# EAGLE design Adafruit Mini PiTFT - 135x240 Color TFT (EAGLE 9.5.0)
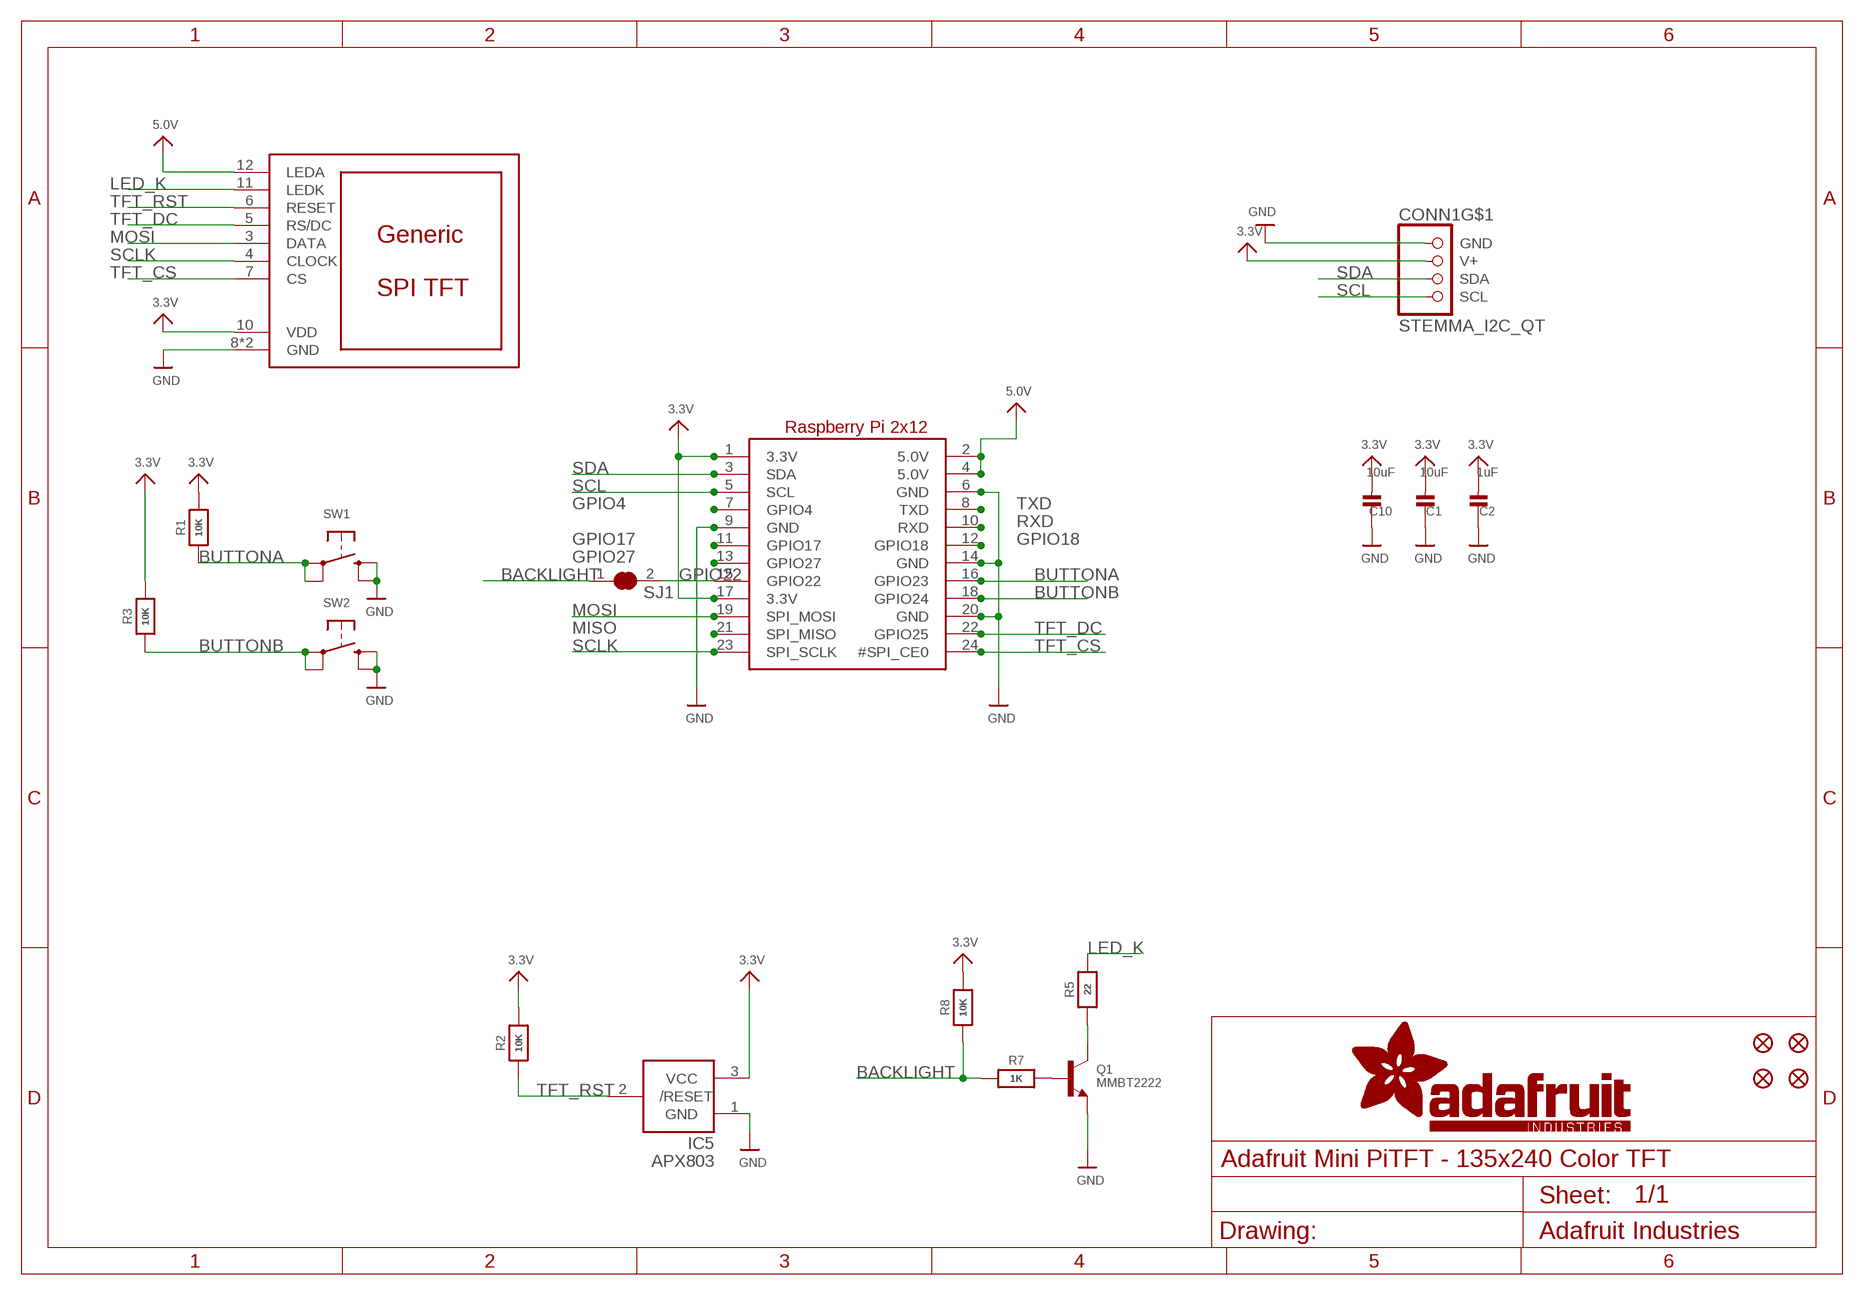
[diagram p0: schematic, sheet 1]

## Parts
C1  10uF  CAP_CERAMIC0805-NOOUTLINE  [0805-NO]
C2  1uF  CAP_CERAMIC0603_NO  [0603-NO]
C10  10uF  CAP_CERAMIC0805-NOOUTLINE  [0805-NO]
CONN1  STEMMA_I2C_QT  [JST_SH4]
DISP1  DISP_LCD_GENERIC_SPI_1.14IN_13P  [TFT_1.14IN_240X135_WRAPAROUND]
FID1  FIDUCIAL_1MM  [FIDUCIAL_1MM]
FID2  FIDUCIAL_1MM  [FIDUCIAL_1MM]
FID3  FIDUCIAL_1MM  [FIDUCIAL_1MM]
FID4  FIDUCIAL_1MM  [FIDUCIAL_1MM]
IC5  APX803  AXP083-SAG  [SOT23]
Q1  MMBT2222  TRANSISTOR_NPNWIDE  [SOT23-WIDE]
R1  10K  RESISTOR_0603_NOOUT  [0603-NO]
R2  10K  RESISTOR_0603_NOOUT  [0603-NO]
R3  10K  RESISTOR_0603_NOOUT  [0603-NO]
R5  22  RESISTOR_0603_NOOUT  [0603-NO]
R7  1K  RESISTOR_0603_NOOUT  [0603-NO]
R8  10K  RESISTOR_0603_NOOUT  [0603-NO]
RASPI1  RASPBERRYPI_2X12_THMSMT  [RASPBERRYPI_2X12_THMSMT]
SJ1  SOLDERJUMPER_CLOSED  [SOLDERJUMPER_CLOSEDWIRE]
SW1  SWITCH_TACT_SMT_EVQQ2_SMALL  [EVQ-Q2_SMALLER]
SW2  SWITCH_TACT_SMT_EVQQ2_SMALL  [EVQ-Q2_SMALLER]

## Nets
3.3V: C1.2 C2.2 C10.2 CONN1.2(V+) DISP1.10(VDD) IC5.3(VCC) R1.2 R2.2 R3.2 R8.2 RASPI1.1(3.3V) RASPI1.17(3.3V)
5.0V: DISP1.12(LEDA) RASPI1.2(5.0V) RASPI1.4(5.0V)
BACKLIGHT: R7.1 R8.1 SJ1.1
BUTTONA: R1.1 RASPI1.16(GPIO23) SW1.A'(P1) SW1.A(P)
BUTTONB: R3.1 RASPI1.18(GPIO24) SW2.A'(P1) SW2.A(P)
GND: C1.1 C2.1 C10.1 CONN1.1(GND) DISP1.8(GND) DISP1.13(GND) IC5.1(GND) Q1.2(E) RASPI1.6(GND) RASPI1.9(GND) RASPI1.14(GND) RASPI1.20(GND) SW1.B'(S1) SW1.B(S) SW2.B'(S1) SW2.B(S)
GPIO4: RASPI1.7(GPIO4)
GPIO17: RASPI1.11(GPIO17)
GPIO18: RASPI1.12(GPIO18)
GPIO22: RASPI1.15(GPIO22) SJ1.2
GPIO27: RASPI1.13(GPIO27)
LED_K: DISP1.11(LEDK) R5.2
MISO: RASPI1.21(SPI_MISO)
MOSI: DISP1.3(DATA) RASPI1.19(SPI_MOSI)
N$1: Q1.1(B) R7.2
N$5: Q1.3(C) R5.1
RXD: RASPI1.10(RXD)
SCL: CONN1.4(SCL) RASPI1.5(SCL)
SCLK: DISP1.4(CLOCK) RASPI1.23(SPI_SCLK)
SDA: CONN1.3(SDA) RASPI1.3(SDA)
TFT_CS: DISP1.7(CS) RASPI1.24(#SPI_CE0)
TFT_DC: DISP1.5(RS/DC) RASPI1.22(GPIO25)
TFT_RST: DISP1.6(RESET) IC5.2(/RESET) R2.1
TXD: RASPI1.8(TXD)
Unconnected: CONN1.MT1(MT) CONN1.MT2(MT)

## Library data of the parts
C1 C2 C10 = microbuilder:CAP_CERAMIC: Ceramic Capacitors For new designs, use the packages preceded by an '_' character since they are more reliable: The following footprints should be used on most boards: _0402 - Standard footprint for regular board layouts _0603 - Standard footprint for regular board layouts _0805 - Standard footprint for regular board layouts _1206 - Standard footprint for regular board layouts For extremely tight-pitch boards where space is at a premium, the following 'micro-pitch' footprints can be used (smaller pads, no silkscreen outline, etc.): _0402MP - Micro-pitch footprint for very dense/compact boards _0603MP - Micro-pitch footprint for very dense/compact boards _0805MP - Micro-pitch footprint for very dense/compact boards _1206MP - Micro-pitch footprint for very dense/compact boards
CONN1 = microbuilder:STEMMA_I2C
DISP1 = adafruit_display:DISP_LCD_GENERIC_SPI
FID1-FID4 = microbuilder:FIDUCIAL: Fiducial Alignment Points Various fiducial points for machine vision alignment.; BOM: EXCLUDE
IC5 = adafruit:AXP083
Q1 = microbuilder:TRANSISTOR_NPN: NPN Transistor Transistor (NPN) 500mA 45V - BC817 [Digikey: 568-1631-1-ND] Transistor (NPN) 500mA 45V - BC817,215 [Mouser: 771-BC817-T/R] SOT23-R - SOT23 footprint optimised for use with solder paste and reflow ovens. SOT23-W - SOT23 footprint optimised for hand-soldering (larger pads).
R1-R3 R5 R7 R8 = microbuilder:RESISTOR: Resistors For new designs, use the packages preceded by an '_' character since they are more reliable: The following footprints should be used on most boards: _0402 - Standard footprint for regular board layouts _0603 - Standard footprint for regular board layouts _0805 - Standard footprint for regular board layouts _1206 - Standard footprint for regular board layouts For extremely tight-pitch boards where space is at a premium, the following 'micro-pitch' footprints can be used (smaller pads, no silkscreen outline, etc.): _0402MP - Micro-pitch footprint for very dense/compact boards _0603MP - Micro-pitch footprint for very dense/compact boards _0805MP - Micro-pitch footprint for very dense/compact boards _1206MP - Micro-pitch footprint for very dense/compact boards
RASPI1 = adafruit_sbc:RASPBERRYPI_2X12
SJ1 = microbuilder:SOLDERJUMPER_CLOSED: Solder Jumper - Closed These solder jumpers are closed by default CLOSEDWIRE - 10 mil trace between pads that can be cut and resoldered later CLOSEDPERM - 63 mil trace between pads for a permanent connection (used to 'bridge' two signals, a shameless hack for Eagle). Can double as a test point as well (no cream layer)
SW1 SW2 = microbuilder:SWITCH_TACT_SMT: SMT Tact Switches 6x6mm - Digikey: P12940SCT-ND KMR2 (4.6x2.8mm) - Digikey: 401-1426-1-ND EVQ-PQHB55 - Light Touch, 160GF (4.5x4.5mm) - Digikey: P8090SCT-ND KMT0 - KMT021 NGJ LHS (etc.) IP68/Waterproof - Digikey: CKN10289CT-ND

## Board
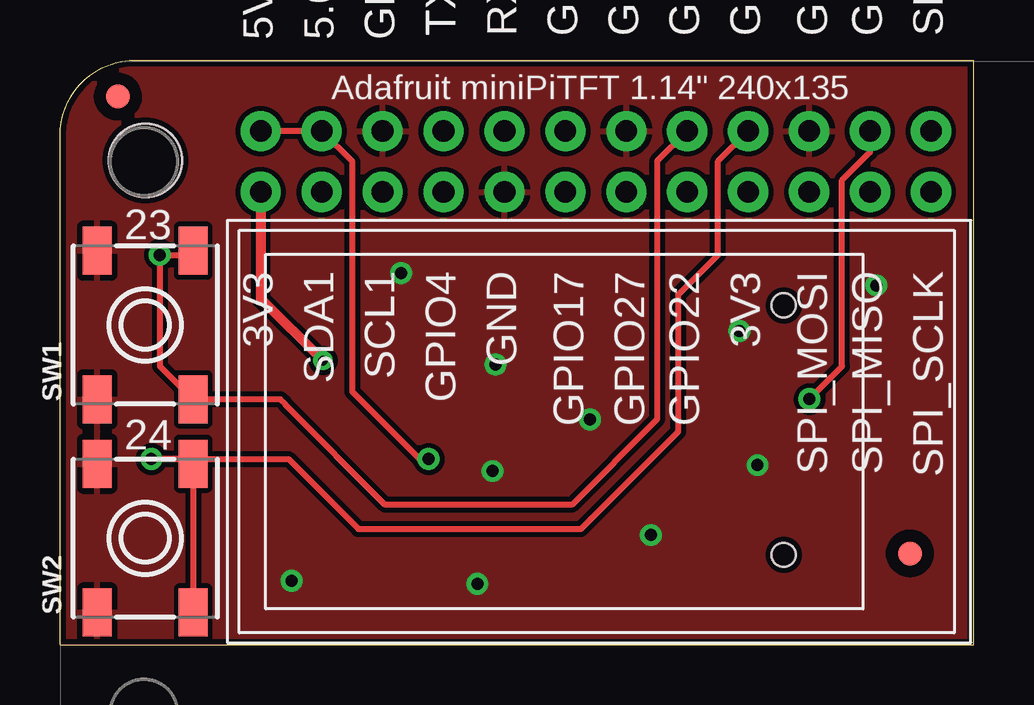
[diagram p1: board, top side]
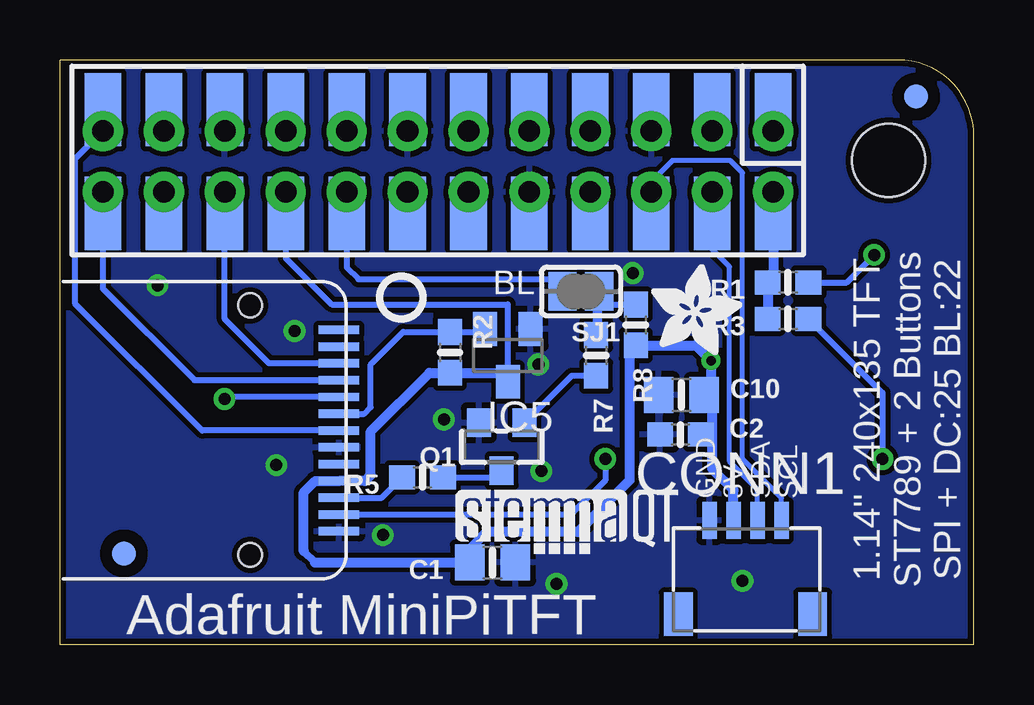
[diagram p2: board, bottom side, seen from below]

Size 38.1 x 24.38 mm. Coordinates in mm from the lower left corner, seen from the top.
Outline: 0,0 38.1,0 38.1,24.38 3.17,24.38 arc90 0,21.21 0,0
Copper layers (1*16): Top 0.035mm / dielectric 1.5mm / Bottom 0.035mm
Design rules "adafruit *": minimum track width 8mil, minimum drill 15.5mil, track to track 8mil, track to pad 8mil, pad to pad 8mil, via to via 8mil, smd to smd 8mil, copper to edge 10mil, drill to drill 8mil, minimum pad ring 10mil, minimum via ring 8mil, stop-mask expansion 2mil, vias tented up to drill 20mil, thermal gap 10mil
Holes 3.05 mm at 3.56,20.19

### Footprints (pad centres in the part's own frame; a part is rotated, then mirrored left to right if it is on the bottom)
0805-NO = smd 1.24 x 1.5: 1 -0.95,0; 2 0.95,0
0603-NO = smd 1.075 x 1: 1 -0.85,0; 2 0.85,0
JST_SH4 = smd 0.6 x 1.55: 1 -1.5,2.514; 2 -0.5,2.514; 3 0.5,2.514; 4 1.5,2.514 | smd 1.2 x 1.8: MT1 -2.8,-1.386; MT2 2.8,-1.386
TFT_1.14IN_240X135_WRAPAROUND = smd 0.35 x 1.7 bottom: 1 4.24,11.5; 2 3.54,11.5; 3 2.84,11.5; 4 2.14,11.5; 5 1.44,11.5; 6 0.74,11.5; 7 0.04,11.5; 8 -0.66,11.5; 9 -1.36,11.5; 10 -2.06,11.5; 11 -2.76,11.5; 12 -3.46,11.5; 13 -4.16,11.5 | hole 1: -5.14,7.8; 5.26,7.8
FIDUCIAL_1MM = smd 1 x 1: 1 0,0
SOT23 = smd 1 x 1.4: 1 -0.95,-1.1; 2 0.95,-1.1; 3 0,1.1
SOT23-WIDE = smd 1 x 1.2: 1 -0.95,-1; 2 0.95,-1; 3 0,1
RASPBERRYPI_2X12_THMSMT = drill 0.9 pad 1.676: 1 8.37,25.23; 2 8.37,27.77; 3 10.91,25.23; 4 10.91,27.77; 5 13.45,25.23; 6 13.45,27.77; 7 15.99,25.23; 8 15.99,27.77; 9 18.53,25.23; 10 18.53,27.77; 11 21.07,25.23; 12 21.07,27.77; 13 23.61,25.23; 14 23.61,27.77; 15 26.15,25.23; 16 26.15,27.77; 17 28.69,25.23; 18 28.69,27.77; 19 31.23,25.23; 20 31.23,27.77; 21 33.77,25.23; 22 33.77,27.77; 23 36.31,25.23; 24 36.31,27.77 | smd 1.524 x 3.048 bottom: S1 8.37,24.339; S2 8.37,28.657; S3 10.91,24.339; S4 10.91,28.657; S5 13.45,24.339; S6 13.45,28.657; S7 15.99,24.339; S8 15.99,28.657; S9 18.53,24.339; S10 18.53,28.657; S11 21.07,24.339; S12 21.07,28.657; S13 23.61,24.339; S14 23.61,28.657; S15 26.15,24.339; S16 26.15,28.657; S17 28.69,24.339; S18 28.69,28.657; S19 31.23,24.339; S20 31.23,28.657; S21 33.77,24.339; S22 33.77,28.657; S23 36.31,24.339; S24 36.31,28.657
SOLDERJUMPER_CLOSEDWIRE = smd 1.168 x 1.6: 1 -0.762,0; 2 0.762,0 | smd 0.635 x 0.203: WIRE 0,0
EVQ-Q2_SMALLER = smd 2 x 1.2: A -3.1,-2; A' 3.1,-2; B -3.1,2; B' 3.1,2

### Placement (x,y rotation side)
C1  20.07,3.43 180 bottom
C2  12.23,8.76 0 bottom
C10  12.19,10.41 0 bottom
CONN1  9.53,2.67 0 bottom
DISP1  37.97,8.89 90 top
FID1  2.41,22.86 0 top
FID2  35.43,3.81 0 top
FID3  35.43,3.81 0 bottom
FID4  2.41,22.86 0 bottom
IC5  19.43,12.06 180 bottom
Q1  19.68,8.26 180 bottom
R1  7.75,15.11 180 bottom
R2  21.84,12.19 270 bottom
R3  7.75,13.59 180 bottom
R5  22.99,6.99 180 bottom
R7  15.75,12.06 270 bottom
R8  14.1,13.33 270 bottom
RASPI1  0,-6.35 0 top
SJ1  16.38,14.73 180 bottom
SW1  3.56,13.33 90 top
SW2  3.56,4.45 90 top
U$4  MICROSD  [ADAFRUIT_3.5MM]  13.46,12.06 0 bottom
U$6  [PCBFEAT-REV-040]  23.88,14.48 0 bottom
U$15  [STEMMAQT]  21.59,3.81 0 bottom

### Tracks (layer width: path | path; a pad name or v marks a point on that pad's centre or on a via)
3.3V  (via drill 0.39)
  Top 0.406: RASPI1.1 8.37,14.44 v10.96,11.85
  Bottom 0.203: C1.2 21.02,4
  Bottom 0.254: IC5.3 19.42,10.97 19.42,11.43 19.42,14.2 26.77,14.2 28.69,16.12 RASPI1.17 | 8.37,15.34 R1.2 | C10.2 10.96,10.41
  Bottom 0.305: 27.94,3.9 27.47,3.43
  Bottom 0.406: 27.94,3.9 27.94,6.35 27.46,6.83 DISP1.10 25.39,6.83 25.15,7.07 25.15,8.89 22.69,11.34 R2.2 19.51,11.34 19.42,11.43 | 27.47,3.43 C1.2 | 21.02,4 20.32,4.7 16.51,4.7 14.35,6.86 14.35,12.23 R8.2 11.6,12.49 v10.96,11.85 10.96,10.41 | 10.91,8.76 10.91,7.34 10.03,6.45 CONN1.2 | RASPI1.1 8.37,15.34 | R1.2 R3.2 | C2.2 10.91,8.76 | C10.2 10.91,10.09 10.91,8.76
5.0V  (via drill 0.5)
  Top 0.254: v15.37,7.75 14.99,7.75 12.19,10.54 12.19,20.14 RASPI1.4 RASPI1.2
  Bottom 0.254: DISP1.12 16.8,5.43 15.37,6.86 v15.37,7.75
BACKLIGHT
  Bottom 0.254: R8.1 15.75,14.19 R7.1 15.62,13.04 SJ1.1
BUTTONA  (via drill 0.5)
  Top 0.254: SW1.A' 5.38,16.26 v4.16,16.26 4.16,11.63 SW1.A 9.2,10.24 9.4,10.03 9.4,10 13.56,5.84 21.34,5.84 24.89,9.4 24.89,20.16 RASPI1.16
  Bottom 0.254: R1.1 5.3,15.11 v4.16,16.26
BUTTONB  (via drill 0.5)
  Top 0.254: SW2.A SW2.A' 5.35,7.75 v3.81,7.75 9.53,7.75 12.45,4.83 21.72,4.83 25.78,8.89 25.78,14.6 27.43,16.26 27.43,20.16 RASPI1.18
  Bottom 0.254: R3.1 3.81,10.5 v3.81,7.75
GND  (via drill 0.5)
  other vias: 18.16,11.68 22.1,9.4 18.03,7.24 17.4,2.54 24.64,4.57 29.08,7.49 28.32,13.08 34.04,14.99 14.22,15.49 9.65,2.67
  pour Bottom: 0,24.38 37.97,24.38 37.97,-0.13 0,-0.13
  pour Top: 0,24.38 37.97,24.38 37.97,-0.13 0,-0.13
GPIO22
  Bottom 0.254: RASPI1.15 26.15,15.74 25.65,15.24 17.65,15.24 SJ1.2
LED_K
  Bottom 0.254: DISP1.11 24.69,6.13 R5.2
MOSI
  Bottom 0.254: DISP1.3 29.38,11.73 31.23,13.58 RASPI1.19
N$1
  Bottom 0.254: R7.2 16.77,11.22 Q1.1
N$5
  Bottom 0.254: R5.1 19.95,6.99 Q1.3
SCL
  Bottom 0.203: CONN1.4 8.03,6.12 9.65,7.75 9.65,19.69 10.16,20.19 12.57,20.19 12.64,20.13 12.7,20.07 13.45,19.32 RASPI1.5
SCLK
  Bottom 0.254: DISP1.4 32.49,11.03 36.31,14.85 RASPI1.23
SDA
  Bottom 0.203: CONN1.3 9.03,6.49 10.19,7.65 10.19,15.76 10.92,16.49 10.92,18.87 RASPI1.3
TFT_CS
  Bottom 0.254: DISP1.7 32.17,8.93 37.48,14.24 37.48,20.25 RASPI1.24
TFT_DC  (via drill 0.5)
  Top 0.254: RASPI1.22 33.77,20.53 32.6,19.36 32.6,11.61 v31.24,10.25
  Bottom 0.254: DISP1.5 31.16,10.33 v31.24,10.25
TFT_RST
  Bottom 0.254: IC5.2 20.5,13.04 R2.1 23.79,13.04 25.15,11.68 25.15,9.91 25.42,9.63 DISP1.6

### Text on the board
tPlace: Adafruit miniPiTFT 1.14" 240x135 | 23 | 24
bPlace: BL | 1.14" 240x135 TFT / ST7789 + 2 Buttons / SPI + DC:25 BL:22 | SCL | SDA | 3V | GND | Adafruit MiniPiTFT